# Altium schematic sheet 2023无人机分电板V2.SchDoc
size A3
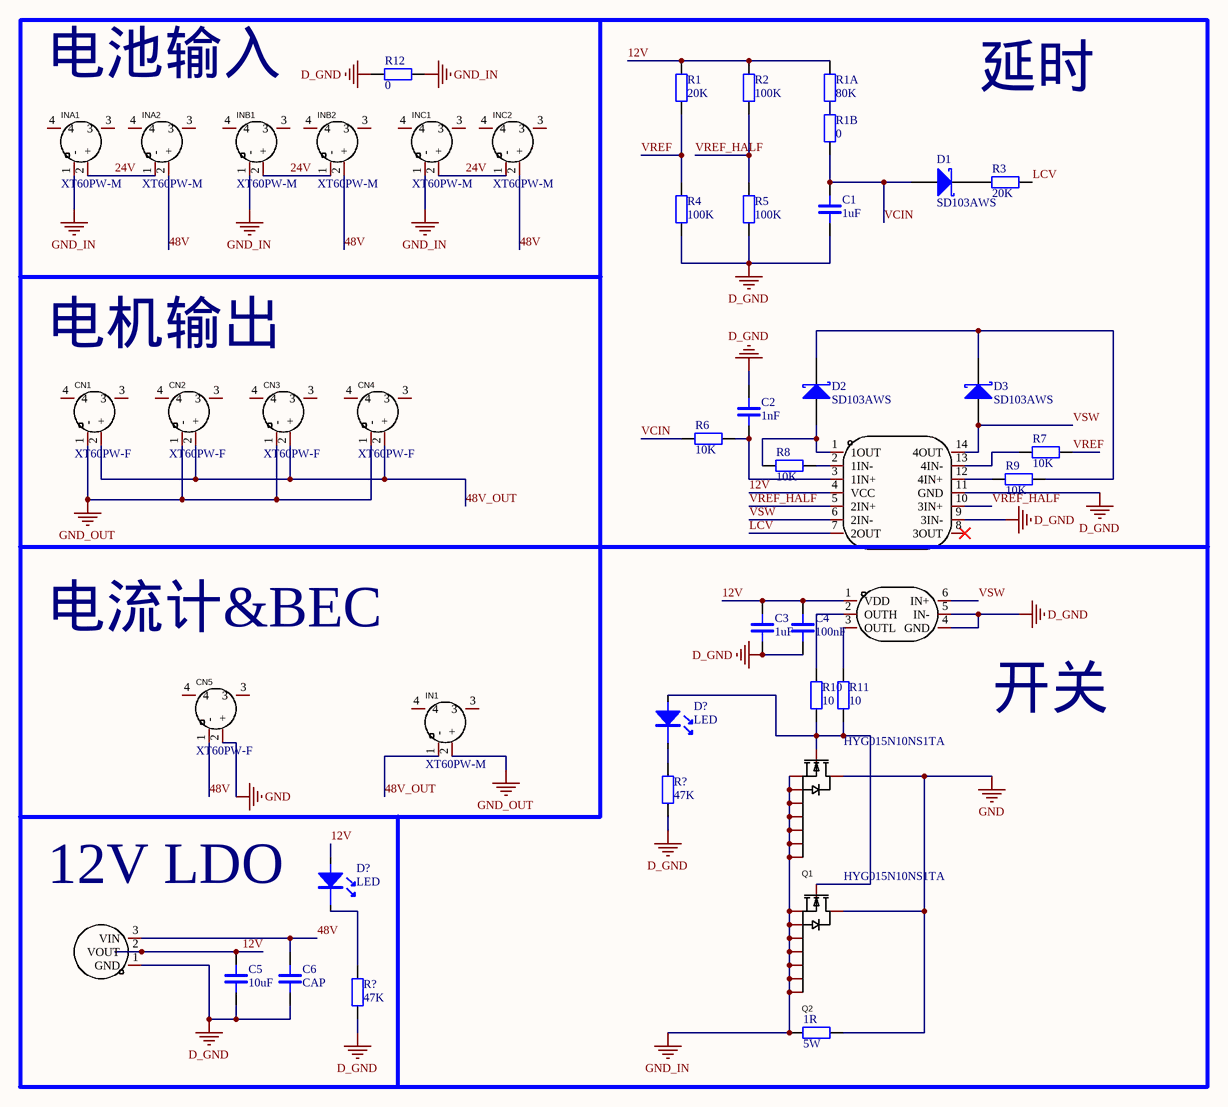
[diagram p0: 2023无人机分电板V2.SchDoc]

## Parts
(Parts that share a designator on the sheet are numbered #1, #2 ... from top to bottom, then left to right.)
1R  5W  [RES-5W]
C1  1uF  [C 0603_L]
C2  1nF  [C 0603_L]
C3  1uF  [C 0603_L]
C4  100nF  [C 0603_L]
C5  10uF  [C 0603_L]
C6  CAP  [C 1210_L]
CN1  XT60PW-F  [CONN-TH_XT60PW-F]
CN2  XT60PW-F  [CONN-TH_XT60PW-F]
CN3  XT60PW-F  [CONN-TH_XT60PW-F]
CN4  XT60PW-F  [CONN-TH_XT60PW-F]
CN5  XT60PW-F  [CONN-TH_XT60PW-F]
D1  SD103AWS  [SOD-323]
D2  SD103AWS  [SOD-323]
D3  SD103AWS  [SOD-323]
D?#1  LED  [LED_0603]
D?#2  LED  [LED_0603]
IN1  XT60PW-M  [CONN-TH_XT60PW-M]
INA1  XT60PW-M  [CONN-TH_XT60PW-M]
INA2  XT60PW-M  [CONN-TH_XT60PW-M]
INB1  XT60PW-M  [CONN-TH_XT60PW-M]
INB2  XT60PW-M  [CONN-TH_XT60PW-M]
INC1  XT60PW-M  [CONN-TH_XT60PW-M]
INC2  XT60PW-M  [CONN-TH_XT60PW-M]
Q1  HYG015N10NS1TA  [TOLL-8_L10.4-W9.9-P1.20-LS11.7-BL]
Q2  HYG015N10NS1TA  [TOLL-8_L10.4-W9.9-P1.20-LS11.7-BL]
R1  20K  [R 0603_L]
R1A  80K  [R 0603_L]
R1B  0  [R 0603_L]
R2  100K  [R 0603_L]
R3  20K  [R 0603_L]
R4  100K  [R 0603_L]
R5  100K  [R 0603_L]
R6  10K  [R 0603_L]
R7  10K  [R 0603_L]
R8  10K  [R 0603_L]
R9  10K  [R 0603_L]
R10  10  [R 0603_L]
R11  10  [R 0603_L]
R12  0  [R 0603_L]
R?#1  47K  [R 0603_L]
R?#2  47K  [R 0603_L]
U1  LM324DR  [SOIC-14_L8.7-W3.9-P1.27-LS6.0-BL]  (value not drawn)
U2  SL27511  [SOT-23-6_L2.9-W1.6-P0.95-LS2.8-BR]  (value not drawn)
U3  ZXTR2112F-7  [SOT-23-3_L2.9-W1.6-P1.90-LS2.8-BR]  (value not drawn)

## Nets
D_GND: C1.1 C2.2 C3.1 C4.1 C5.1 C6.2 R4.2 R5.2 R12.2 R?#1.1 R?#2.1 U1.9(3IN-) U1.11(GND) U2.4(GND) U2.5(IN-) U3.1(GND)
GND: 1R.2 CN5.2(+) Q1.9(D) Q2.9(D)
GND_IN: 1R.1 INA1.1(-) INB1.1(-) INC1.1(-) Q1.2(S) Q1.3(S) Q1.4(S) Q1.5(S) Q1.6(S) Q1.7(S) Q1.8(S) Q2.2(S) Q2.3(S) Q2.4(S) Q2.5(S) Q2.6(S) Q2.7(S) Q2.8(S) R12.1
GND_OUT: CN1.1(-) CN2.1(-) CN3.1(-) CN4.1(-) IN1.2(+)
12V: C3.2 C4.2 C5.2 D?#2.1 R1.1 R1A.1 R2.1 U1.4(VCC) U2.1(VDD) U3.2(VOUT)
24V: INA1.2(+) INA2.1(-) INB1.2(+) INB2.1(-) INC1.2(+) INC2.1(-)
48V: C6.1 CN5.1(-) INA2.2(+) INB2.2(+) INC2.2(+) U3.3(VIN)
48V_OUT: CN1.2(+) CN2.2(+) CN3.2(+) CN4.2(+) IN1.1(-)
LCV: R3.2 U1.7(2OUT)
VCIN: C1.2 D1.1(A) R1B.2 R6.1
VREF: R1.2 R4.1 R7.2
VREF_HALF: R2.2 R5.1 U1.5(2IN+) U1.10(3IN+)
VSW: D3.1(A) U1.6(2IN-) U1.14(4OUT) U2.6(IN+)
NetC2_1: C2.1 R6.2 U1.3(1IN+)
NetD1_2: D1.2(K) R3.1
NetD2_1: D2.1(A) R8.1 U1.1(1OUT)
NetD2_2: D2.2(K) D3.2(K) R9.2
NetD?#1_1: D?#1.1 Q1.1(G) Q2.1(G) R10.1 R11.1
NetD?#1_2: D?#1.2 R?#1.2
NetD?#2_2: D?#2.2 R?#2.2
NetR1A_2: R1A.2 R1B.1
NetR7_1: R7.1 U1.13(4IN-)
NetR8_2: R8.2 U1.2(1IN-)
NetR9_1: R9.1 U1.12(4IN+)
NetR10_2: R10.2 U2.2(OUTH)
NetR11_2: R11.2 U2.3(OUTL)

Not connected (* = marked no-connect by the designer): CN1 3 4; CN2 3 4; CN3 3 4; CN4 3 4; CN5 3 4; IN1 3 4; INA1 3 4; INA2 3 4; INB1 3 4; INB2 3 4; INC1 3 4; INC2 3 4; U1 8(3OUT)*

## Notes on the sheet
- 电池输入
- 延时
- 电机输出
- 电流计&BEC
- 开关
- (near U3) 12V LDO

## Library data of the parts
1R R1 R1A R1B R2-R12 R?#1 R?#2 = RES: 贴片电阻
C1-C6 = CAP: 陶瓷电容
CN1-CN5 = XT60PW-F: pin to pad: 1>2 2>1; Manufacturer: AMASS(艾迈斯); Name: XT60PW-M; Add into BOM: yes; Symbol: XT60PW-M; Device: XT60PW-M; LCSC Part Name: XT60PW 公头 板插卧式; Supplier Part: C98732; Manufacturer Part: XT60PW-M; Supplier Footprint: -; JLCPCB Part Class: Extended Part; Datasheet: https://atta.szlcsc.com/upload/public/pdf/source/20180125/C98732_15168617837851301983.pdf; Supplier: LCSC; Convert to PCB: yes
D1-D3 = SD103AWS: 肖特基二极管; 属性: 40V/1A; BOM名称: 肖特基二极管
D?#1 D?#2 = LED: 发光二极管
IN1 INA1 INA2 INB1 INB2 INC1 INC2 = XT60PW-M: Manufacturer: AMASS(艾迈斯); Add into BOM: yes; Name: XT60PW-M; Symbol: XT60PW-M; Device: XT60PW-M; LCSC Part Name: XT60PW 公头 板插卧式; Supplier Part: C98732; Manufacturer Part: XT60PW-M; Supplier Footprint: -; JLCPCB Part Class: Extended Part; Datasheet: https://atta.szlcsc.com/upload/public/pdf/source/20180125/C98732_15168617837851301983.pdf; Supplier: LCSC; Convert to PCB: yes
Q1 Q2 = HYG015N10NS1TA: Manufacturer: HUAYI(华羿微); Add into BOM: yes; Type: N沟道; Drain Source Voltage (Vdss): 100V; Continuous Drain Current (Id): 380A; Power Dissipation (Pd): 428.5W; Drain Source On Resistance (RDS(on)@Vgs,Id): 1.2mΩ@10V,100A; Gate Threshold Voltage (Vgs(th)@Id): 3V@250uA; Total Gate Charge (Qg@Vgs): 205nC@10V; Input Capacitance (Ciss@Vds): 12.3nF@25V; Reverse Transfer Capacitance (Crss@Vds): 250pF@25V; Name: HYG015N10NS1TA; Symbol: HYG015N10NS1TA; Device: HYG015N10NS1TA; LCSC Part Name: N沟道 100V 380A; Supplier Part: C2979263; Manufacturer Part: HYG015N10NS1TA; Supplier Footprint: TOLL-8; JLCPCB Part Class: Extended Part; Datasheet: https://atta.szlcsc.com/upload/public/pdf/source/20220303/83427DBE0CDF10F23F3FDD49B9C9CFAE.pdf; Supplier: LCSC; Convert to PCB: yes; Operating Temperature: -55℃~+175℃@(Tj)
U1 = LM324DR: Manufacturer: TI(德州仪器); Add into BOM: yes; Amplifier Type: General Purpose; Number of Circuits: 4; Gain Bandwidth Product（GBP）: 1.2MHz; Slew Rate（SR）: 0.5 V/us; Supply Voltage（Single）: 3V ~ 32V, ±1.5V ~ 16V; Iq per channel (Typ): 1.4mA; Name: LM324DR; Symbol: LM324DR; Device: LM324DR; LCSC Part Name: LM324DR; Supplier Part: C7943; Manufacturer Part: LM324DR; Supplier Footprint: SOIC-14; JLCPCB Part Class: Extended Part; Datasheet: https://atta.szlcsc.com/upload/public/pdf/source/20140704/1457707114488.pdf; Supplier: LCSC; Convert to PCB: yes; Output Type: -; Operating Temperature: 0°C ~ 70°C
U2 = SL27511: Manufacturer: Slkor(萨科微); Add into BOM: yes; Driven Configuration: 低边; Number of Drivers: 1; loadtype: MOSFET；IGBT; Whether the isolation: 非隔离; Supply Voltage: 4.5V~20V; Peak Output Current(sink): 8A; Peak Output Current(source): 4A; Rise Time: 6ns; Fall Time: 4.5ns; Propagation Delay tpLH: 16ns; Name: SL27511; Symbol: SL27511; Device: SL27511; LCSC Part Name: 低边 IGBT MOSFET 灌:8A 拉:4A; Supplier Part: C2681373; Manufacturer Part: SL27511; Supplier Footprint: SOT-23-6; JLCPCB Part Class: Extended Part; Datasheet: https://atta.szlcsc.com/upload/public/pdf/source/20210108/C2681373_CD41C44CDBB9248B0528B6216F344054.pdf; Supplier: LCSC; Convert to PCB: yes; Propagation Delay tpHL: 16ns; Feature: 欠压保护(UVP); Operating Temperature: -40℃~+125℃@(Ta)
U3 = ZXTR2112F-7: Manufacturer: DIODES(美台); Add into BOM: yes; Output Type: 固定; Output Polarity: 正; Number of Outputs: 1; Maximum Input Voltage: 60V; Output Voltage: 12V; Output Current: 50mA; Power Supply Rejection Ratio (PSRR): 50dB@(100Hz); Name: ZXTR2112F-7; Symbol: ZXTR2112F-7; Device: ZXTR2112F-7; LCSC Part Name: 正 Vin=60V Vout=12V 50mA 50dB@(100Hz); Supplier Part: C441831; Manufacturer Part: ZXTR2112F-7; Supplier Footprint: SOT-23; JLCPCB Part Class: Extended Part; Datasheet: https://atta.szlcsc.com/upload/public/pdf/source/20191028/C441831_30B6D71C82CD52B81E1403E5F67B24E2.pdf; Supplier: LCSC; Convert to PCB: yes; Dropout Voltage: -